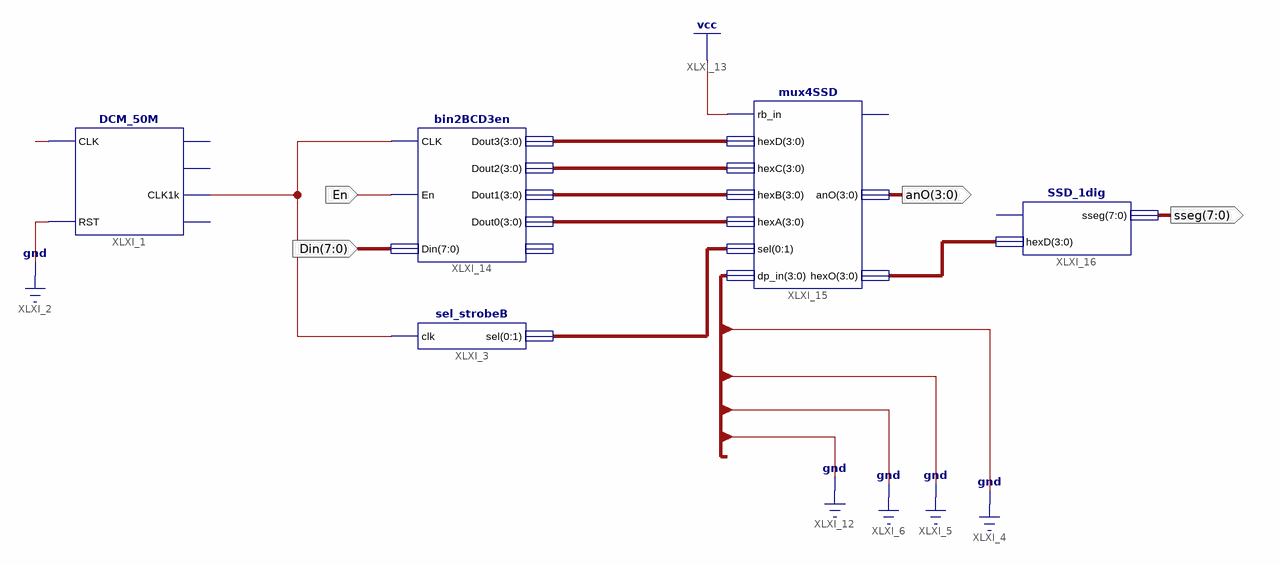
[diagram p0: schematic sheet 1]
// Xilinx ISE schematic bcd_binary.sch (spartan3e) as structural Verilog: 5 symbols, 4 ports
module bcd_binary (
  input  En,
  input  [7:0] Din,
  output [7:0] sseg,
  output [3:0] anO
);

  wire Clock, XLXN_31;
  wire [1:0] XLXN_15;
  wire [3:0] XLXN_3, XLXN_5, XLXN_6, XLXN_7, XLXN_8;

  DCM_50M XLXI_1 (.CLK(Clock), .RST(1'b0), .CLK1k(XLXN_31));  // open: CLK1M, CLK10k, CLK1
  sel_strobeB XLXI_3 (.clk(XLXN_31), .sel({XLXN_15[0], XLXN_15[1]}));
  bin2BCD3en XLXI_14 (
    .CLK(XLXN_31), .En(En), .Din(Din), .Dout3(XLXN_6), .Dout2(XLXN_5), .Dout1(XLXN_7), .Dout0(XLXN_3));  // open: RBout
  mux4SSD XLXI_15 (
    .rb_in(1'b1), .hexD(XLXN_6), .hexC(XLXN_5), .hexB(XLXN_7), .hexA(XLXN_3), .sel({XLXN_15[0], XLXN_15[1]}),
    .dp_in(4'b0000), .anO(anO), .hexO(XLXN_8));  // open: dpO
  SSD_1dig XLXI_16 (.hexD(XLXN_8), .sseg(sseg));  // open: dp_in
endmodule
